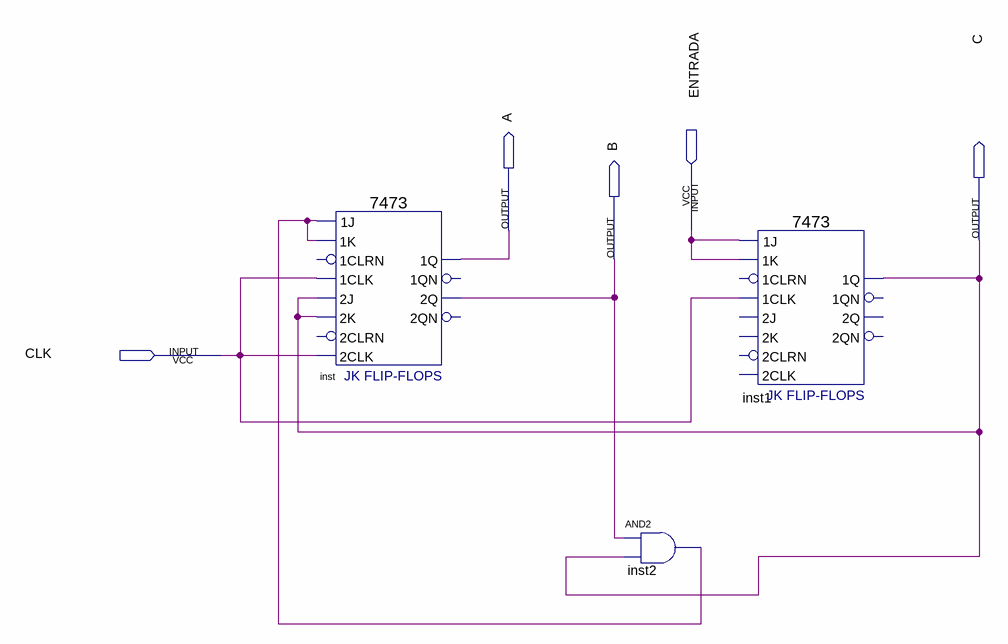
[diagram p0: schematic sheet]
// Quartus schematic CONTADOR.bdf as structural Verilog: 3 symbols, 5 pins
module CONTADOR (
  input  ENTRADA,
  input  CLK,
  output A,
  output C,
  output B
);

  wire inst2_out;

  \7473  inst (
    .\1J (inst2_out), .\1K (inst2_out), .\1CLK (CLK), .\2J (C), .\2CLK (CLK), .\2K (C), .\2Q (B), .\1Q (A));  // open: 1CLRN, 2CLRN, 1QN, 2QN
  and inst2 (inst2_out, B, C);
  \7473  inst1 (
    .\1J (ENTRADA), .\1K (ENTRADA), .\1CLK (CLK), .\1Q (C));  // open: 1CLRN, 2J, 2CLK, 2CLRN, 2K, 1QN, 2Q, 2QN
endmodule
